# EAGLE design ResTestMotor (EAGLE 9.6.2)
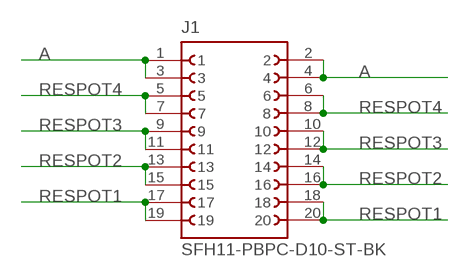
[diagram p0: schematic, sheet 1]

## Parts
J1  SFH11-PBPC-D10-ST-BK  [SULLINS_SFH11-PBPC-D10-ST-BK]

## Nets
A: J1.1 J1.2 J1.3 J1.4
RESPOT1: J1.17 J1.18 J1.19 J1.20
RESPOT2: J1.13 J1.14 J1.15 J1.16
RESPOT3: J1.9 J1.10 J1.11 J1.12
RESPOT4: J1.5 J1.6 J1.7 J1.8

## Library data of the parts
J1 = SFH11-PBPC-D10-ST-BK:SFH11-PBPC-D10-ST-BK; MANUFACTURER: Sullins Connector Solutions; MAXIMUM_PACKAGE_HEIGHT: 8.5 mm; PARTREV: J; SNAPEDA_PN: SFH11-PBPC-D10-ST-BK; STANDARD: Manufacturer Recommendations

## Board
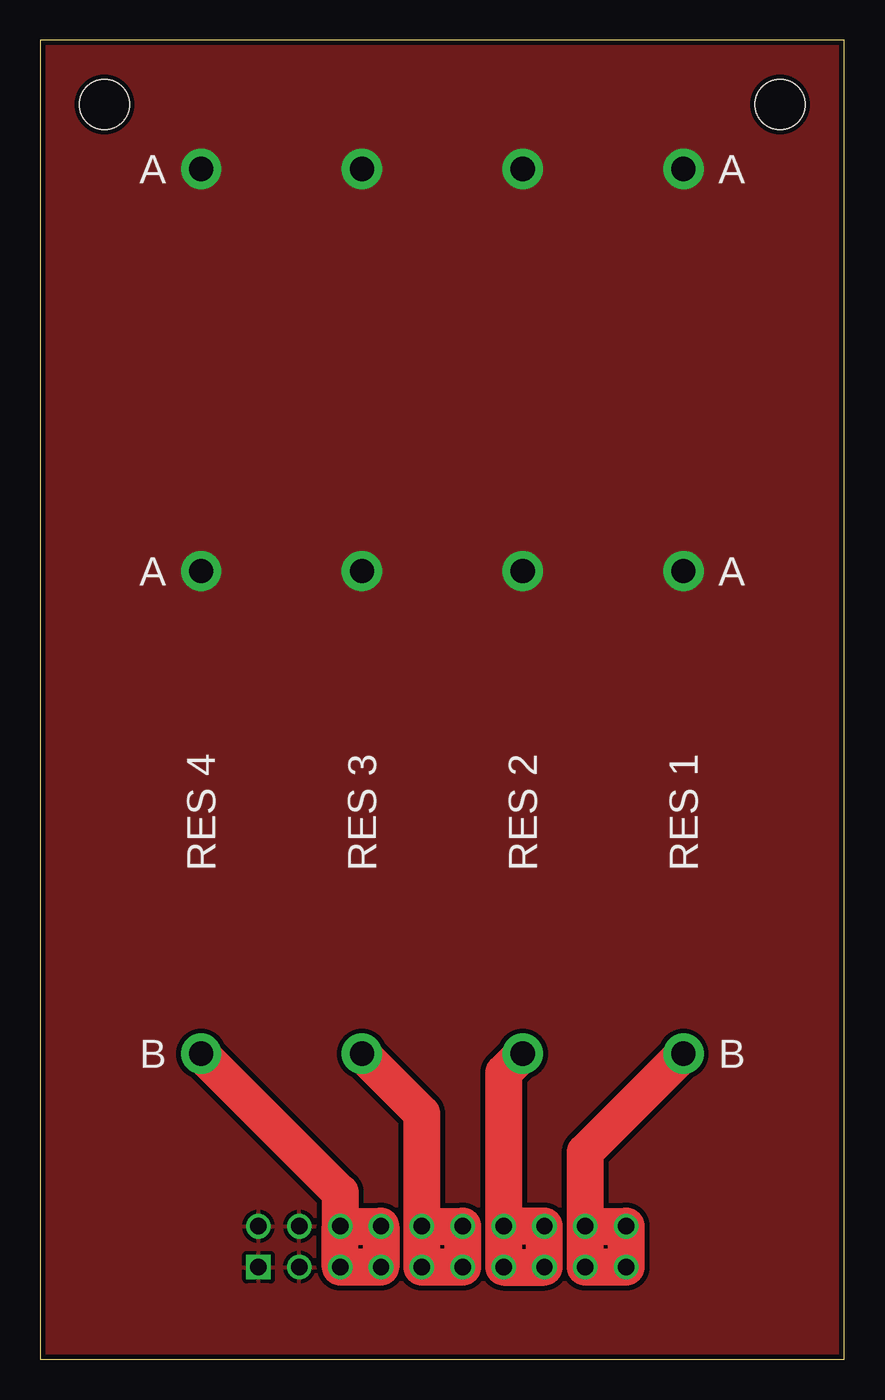
[diagram p1: board, top side]
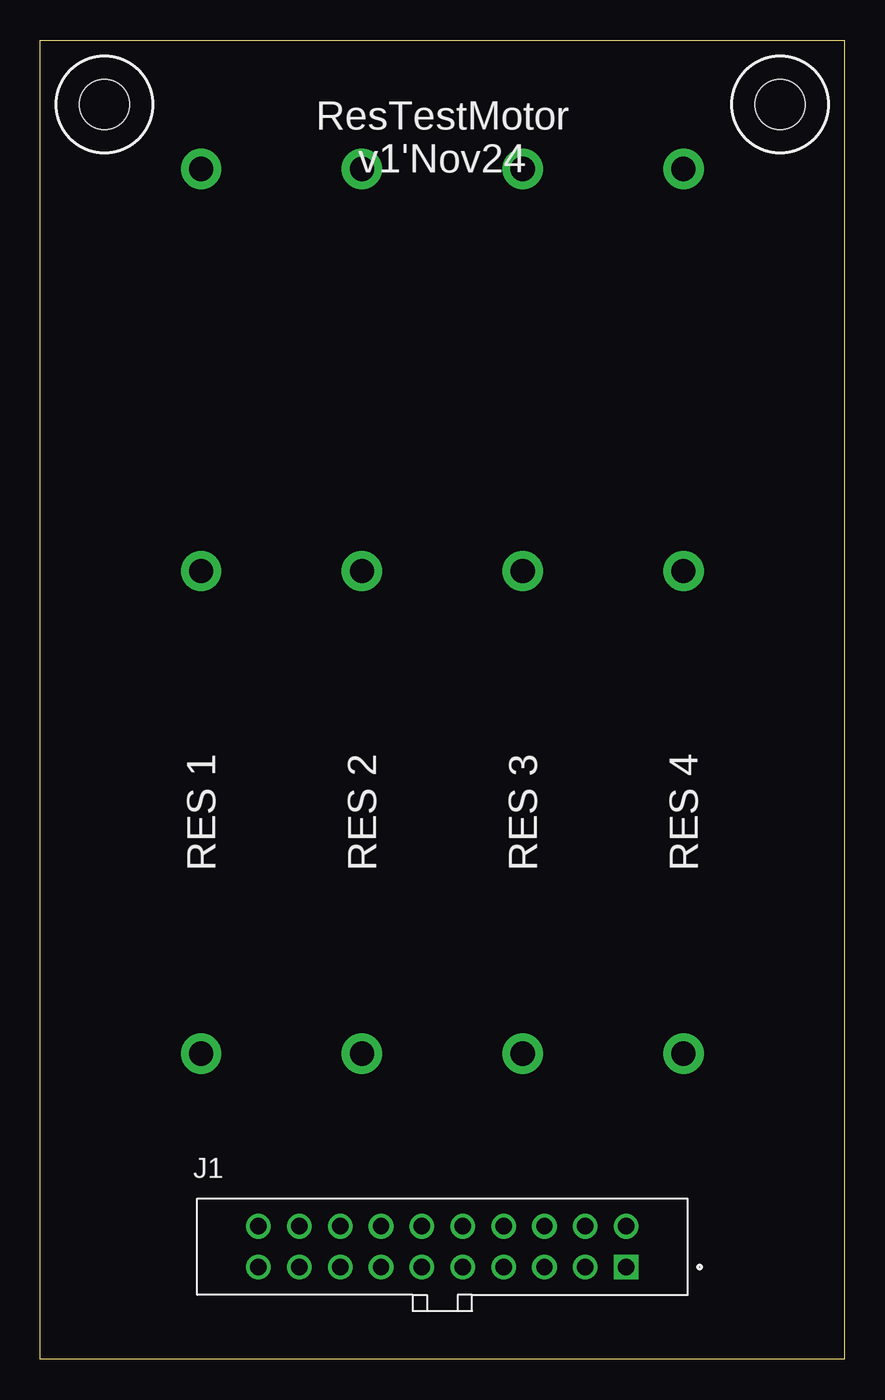
[diagram p2: board, bottom side, seen from below]

Size 50 x 82 mm. Coordinates in mm from the lower left corner, seen from the top.
Outline: 0,0 50,0 50,82 0,82 0,0
Copper layers (1*16): Top 0.035mm / dielectric 1.5mm / Bottom 0.035mm
Design rules "default *": minimum track width 6mil, minimum drill 0.35mm, track to track 6mil, track to pad 6mil, pad to pad 6mil, via to via 6mil, smd to smd 0mil, copper to edge 12mil, drill to drill 6mil, minimum pad ring 10mil, minimum via ring 8mil, stop-mask expansion 4mil, vias tented up to drill 0mil, thermal gap 10mil
Holes 3.1 mm at 4,78 46,78

### Footprints (pad centres in the part's own frame; a part is rotated, then mirrored left to right if it is on the bottom)
SULLINS_SFH11-PBPC-D10-ST-BK = drill 1.02 square: 1 11.43,-1.27 | drill 1.02: 2 11.43,1.27; 3 8.89,-1.27; 4 8.89,1.27; 5 6.35,-1.27; 6 6.35,1.27; 7 3.81,-1.27; 8 3.81,1.27; 9 1.27,-1.27; 10 1.27,1.27; 11 -1.27,-1.27; 12 -1.27,1.27; 13 -3.81,-1.27; 14 -3.81,1.27; 15 -6.35,-1.27; 16 -6.35,1.27; 17 -8.89,-1.27; 18 -8.89,1.27; 19 -11.43,-1.27; 20 -11.43,1.27

### Placement (x,y rotation side)
J1  25,7 0 bottom

### Tracks (layer width: path | path; a pad name or v marks a point on that pad's centre or on a via)
A  (via drill 1.5 pad 2.5)
  other vias: 10,49 20,49 30,49 40,49 10,74 20,74 30,74 40,74
  pour Top (isolate 0.305): -4,-3 59,-3 59,84 -4,84
RESPOT1  (via drill 1.5 pad 2.5)
  Top 2.3: J1.18 J1.20 J1.19 J1.17 J1.18 | J1.18 33.89,12.89 v40,19
RESPOT2  (via drill 1.5 pad 2.5)
  Top 2.3: v30,19 28.81,17.81 J1.14 | J1.14 J1.13 J1.15 J1.16 J1.14
RESPOT3  (via drill 1.5 pad 2.5)
  Top 2.3: J1.10 J1.12 J1.11 J1.9 J1.10 | J1.10 23.73,15.27 v20,19
RESPOT4  (via drill 1.5 pad 2.5)
  Top 2.3: v10,19 18.65,10.35 J1.6 | J1.6 J1.5 J1.7 J1.8 J1.6

### Text on the board
tPlace: A | A | A | A | RES 4 | RES 3 | RES 2 | RES 1 | B | B
bPlace: ResTestMotor / v1'Nov24 | RES 4 | RES 3 | RES 2 | RES 1